# Altium project USB_UART_JTAG.PrjPcb
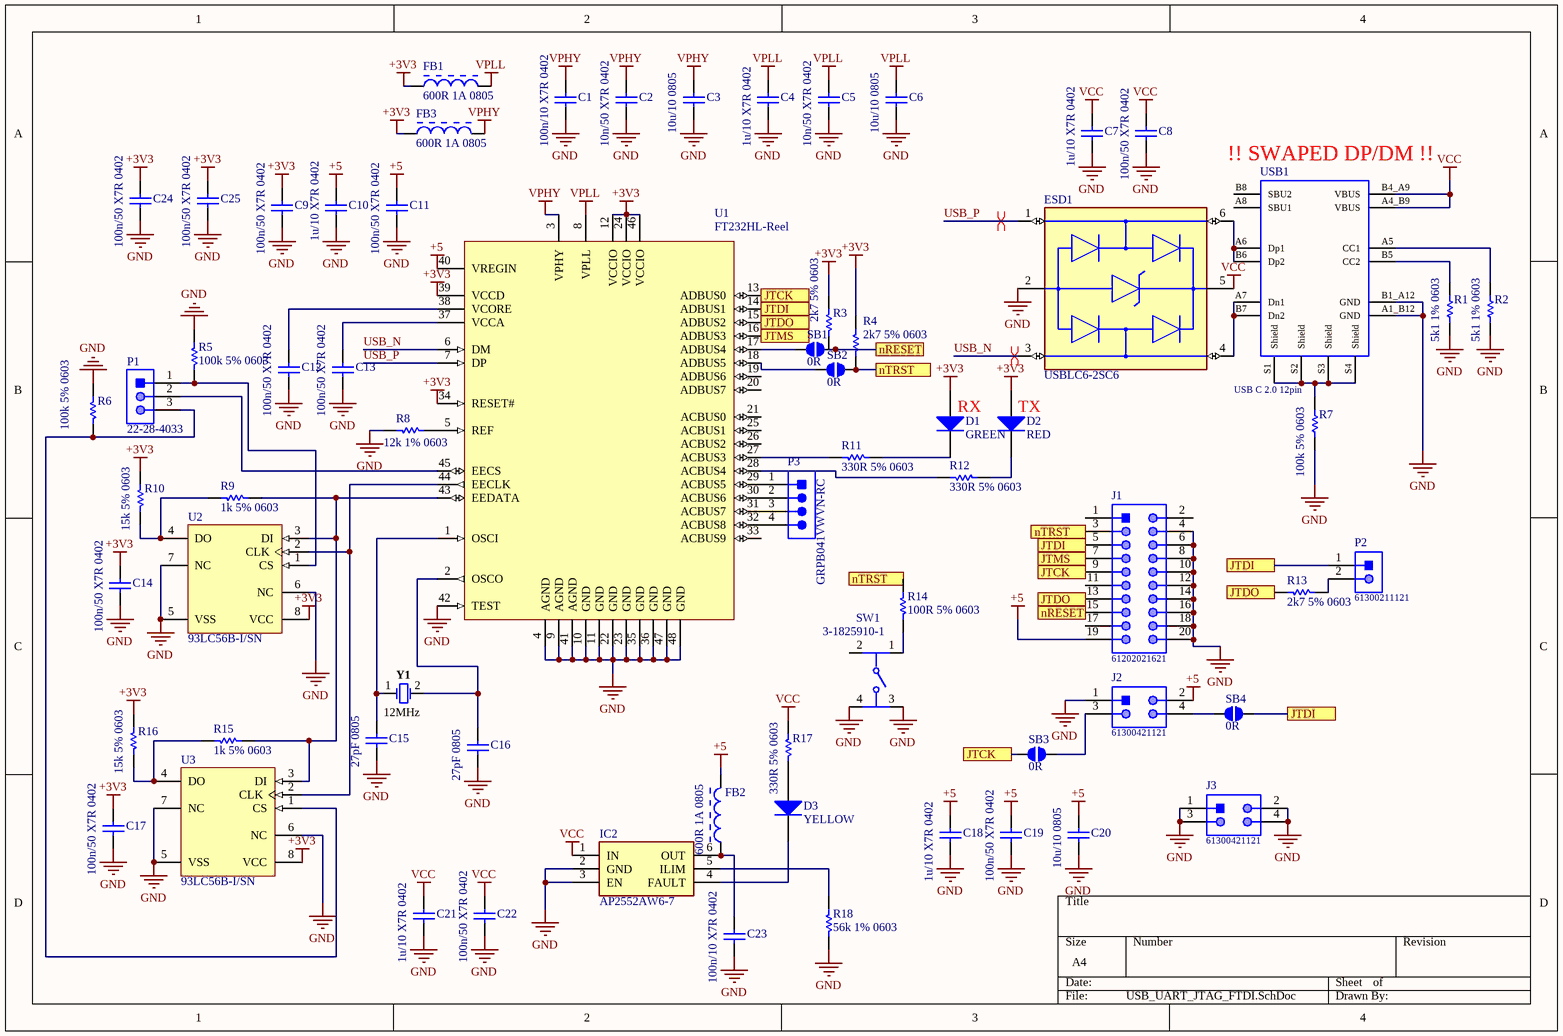
[diagram p0: USB_UART_JTAG_FTDI.SchDoc]
1 sheet, 67 parts. Net scope: flat (ports and power ports of the same name join across sheets).
Board file: USB_UART_JTAG.PcbDoc

## Sheet USB_UART_JTAG_FTDI.SchDoc
size A4

### Parts
C1  100n/10 X7R 0402  [CAPC1005X55X25NL05T10]
C2  10n/50 X7R 0402  [CAPC1005X55X25NL05T10]
C3  10u/10 0805  [CAPC2013X135X50NL10T20]
C4  1u/10 X7R 0402  [CAPC1005X55X25NL05T10]
C5  10n/50 X7R 0402  [CAPC1005X55X25NL05T10]
C6  10u/10 0805  [CAPC2013X135X50NL10T20]
C7  1u/10 X7R 0402  [CAPC1005X55X25NL05T10]
C8  100n/50 X7R 0402  [CAPC1005X55X25NL05T10]
C9  100n/50 X7R 0402  [CAPC1005X55X25NL05T10]
C10  1u/10 X7R 0402  [CAPC1005X55X25NL05T10]
C11  100n/50 X7R 0402  [CAPC1005X55X25NL05T10]
C12  100n/50 X7R 0402  [CAPC1005X55X25NL05T10]
C13  100n/50 X7R 0402  [CAPC1005X55X25NL05T10]
C14  100n/50 X7R 0402  [CAPC1005X55X25NL05T10]
C15  27pF 0805  [CAPC0603(1608)100_N]
C16  27pF 0805  [CAPC0603(1608)100_N]
C17  100n/50 X7R 0402  [CAPC1005X55X25NL05T10]
C18  1u/10 X7R 0402  [CAPC1005X55X25NL05T10]
C19  100n/50 X7R 0402  [CAPC1005X55X25NL05T10]
C20  10u/10 0805  [CAPC2013X135X50NL10T20]
C21  1u/10 X7R 0402  [CAPC1005X55X25NL05T10]
C22  100n/50 X7R 0402  [CAPC1005X55X25NL05T10]
C23  100n/10 X7R 0402  [CAPC1005X55X25NL05T10]
C24  100n/50 X7R 0402  [CAPC1005X55X25NL05T10]
C25  100n/50 X7R 0402  [CAPC1005X55X25NL05T10]
D1  GREEN  [OSRM-LG L29K-F2J1-24_V]
D2  RED  [OSRM-LG L29K-F2J1-24_V]
D3  YELLOW  [OSRM-LG L29K-F2J1-24_V]
ESD1  USBLC6-2SC6  [SOT95P280X145-6N]
FB1  600R 1A 0805  [TDK-MPZ2012_V]
FB2  600R 1A 0805  [TDK-MPZ2012_V]
FB3  600R 1A 0805  [TDK-MPZ2012_V]
IC2  AP2552AW6-7  [SOT95P285X140-6N]
J1  61202021621  [61202021621]
J2  61300421121  [61300421121]
J3  61300421121  [61300421121]
P1  22-28-4033  [MOLX-22-28-4033_V]
P2  61300211121  [61300211121]
P3  GRPB041VWVN-RC  [SLIN-GRPB041VWVN-RC_V]
R1  5k1 1% 0603  [RESC1609X50X30LL10T20]
R2  5k1 1% 0603  [RESC1609X50X30LL10T20]
R3  2k7 5% 0603  [RESC1608X55X30ML20T20]
R4  2k7 5% 0603  [RESC1608X55X30ML20T20]
R5  100k 5% 0603  [RESC1608X55X30ML20T20]
R6  100k 5% 0603  [RESC1608X55X30ML20T20]
R7  100k 5% 0603  [RESC1609X50X30ML10T20]
R8  12k 1% 0603  [RESC1608X55X30ML20T20]
R9  1k 5% 0603  [RESC1608X55X30ML20T20]
R10  15k 5% 0603  [RESC1608X55X30ML20T20]
R11  330R 5% 0603  [RESC1608X55X30ML20T20]
R12  330R 5% 0603  [RESC1608X55X30ML20T20]
R13  2k7 5% 0603  [RESC1608X55X30ML20T20]
R14  100R 5% 0603  [RESC1608X55X30ML20T20]
R15  1k 5% 0603  [RESC1608X55X30ML20T20]
R16  15k 5% 0603  [RESC1608X55X30ML20T20]
R17  330R 5% 0603  [RESC1608X55X30ML20T20]
R18  56k 1% 0603  [RESC1608X55X30ML20T20]
SB1  0R  [SB0603]
SB2  0R  [SB0603]
SB3  0R  [SB0603]
SB4  0R  [SB0603]
SW1  3-1825910-1  [FP-3-1825910-1-MFG]
U1  FT232HL-Reel  [LQFP-48_M]
U2  93LC56B-I/SN  [SOIC-SN8_L]
U3  93LC56B-I/SN  [SOIC-SN8_L]
USB1  USB C 2.0 12pin  [USB_C_12pin]
Y1  12MHz  [FOX-FOXSLF160-20]

### Ports
JTCK, JTDI, JTDO, JTMS, nRESET, nTRST

### Nets
+3V3: C9.2 C14.2 C17.2 C24.2 C25.2 D1.1(A) D2.1(A) FB1.1 FB3.1 R3.2 R4.2 R10.2 R16.2 U1.12(VCCIO) U1.24(VCCIO) U1.34(RESET#) U1.39(VCCD) U1.46(VCCIO) U2.8(VCC) U3.8(VCC)
+5: C10.2 C11.2 C18.2 C19.2 C20.2 FB2.2 J1.19 J2.2 U1.40(VREGIN)
GND: C1.1 C2.1 C3.1 C4.1 C5.1 C6.1 C7.1 C8.1 C9.1 C10.1 C11.1 C12.1 C13.1 C14.1 C15.1 C16.1 C17.1 C18.1 C19.1 C20.1 C21.1 C22.1 C23.1 C24.1 C25.1 ESD1.2(GND) IC2.2(GND) IC2.3(EN) J1.4 J1.6 J1.8 J1.10 J1.12 J1.14 J1.16 J1.18 J1.20 J2.1 J3.1 J3.2 J3.3 J3.4 R1.2 R2.2 R5.2 R6.2 R7.1 R8.2 R18.1 SW1.3 SW1.4 U1.4(AGND) U1.9(AGND) U1.10(GND) U1.11(GND) U1.22(GND) U1.23(GND) U1.35(GND) U1.36(GND) U1.41(AGND) U1.42(TEST) U1.47(GND) U1.48(GND) U2.5(VSS) U2.6(NC) U2.7(NC) U3.5(VSS) U3.6(NC) U3.7(NC) USB1.A1_B12(GND) USB1.B1_A12(GND)
VCC: C7.2 C8.2 C21.2 C22.2 ESD1.5(VBUS) IC2.1(IN) R17.2 USB1.A4_B9(VBUS) USB1.B4_A9(VBUS)
VPHY: C1.2 C2.2 C3.2 FB3.2 U1.3(VPHY)
VPLL: C4.2 C5.2 C6.2 FB1.2 U1.8(VPLL)
USB_N: ESD1.3(I/O2) U1.6(DM)
USB_P: ESD1.1(I/O1) U1.7(DP)
NetC12_2: C12.2 U1.38(VCORE)
NetC13_2: C13.2 U1.37(VCCA)
NetC15_2: C15.2 U1.1(OSCI) Y1.1
NetC16_2: C16.2 U1.2(OSCO) Y1.2
NetC23_2: C23.2 FB2.1 IC2.6(OUT)
NetD1_2: D1.2(K) R11.2
NetD2_2: D2.2(K) R12.2
NetD3_1: D3.1(A) R17.1
NetD3_2: D3.2(K) IC2.4(FAULT)
NetESD1_4: ESD1.4(I/O2) USB1.A7(Dn1) USB1.B7(Dn2)
NetESD1_6: ESD1.6(I/O1) USB1.A6(Dp1) USB1.B6(Dp2)
NetIC2_5: IC2.5(ILIM) R18.2
NetJ1_3: J1.3 R4.1 R14.2 SB2.1 ; port nTRST
NetJ1_5: J1.5 P2.1 SB4.1 U1.14(ADBUS1) ; port JTDI
NetJ1_7: J1.7 U1.16(ADBUS3) ; port JTMS
NetJ1_9: J1.9 SB3.2 U1.13(ADBUS0) ; port JTCK
NetJ1_13: J1.13 R13.1 U1.15(ADBUS2) ; port JTDO
NetJ1_15: J1.15 R3.1 SB1.1 ; port nRESET
NetJ2_3: J2.3 SB3.1
NetJ2_4: J2.4 SB4.2
NetP1_1: P1.1 R5.1 U2.1(CS)
NetP1_2: P1.2 U1.45(EECS)
NetP1_3: P1.3 R6.1 U3.1(CS)
NetP2_2: P2.2 R13.2
NetP3_1: P3.1 U1.29(ACBUS5)
NetP3_2: P3.2 U1.30(ACBUS6)
NetP3_3: P3.3 U1.31(ACBUS7)
NetP3_4: P3.4 U1.32(ACBUS8)
NetR1_1: R1.1 USB1.B5(CC2)
NetR2_1: R2.1 USB1.A5(CC1)
NetR7_2: R7.2 USB1.S1(Shield) USB1.S2(Shield) USB1.S3(Shield) USB1.S4(Shield)
NetR8_1: R8.1 U1.5(REF)
NetR9_1: R9.1 R10.1 U2.4(DO)
NetR9_2: R9.2 R15.2 U1.43(EEDATA) U2.3(DI) U3.3(DI)
NetR11_1: R11.1 U1.27(ACBUS3)
NetR12_1: R12.1 U1.28(ACBUS4)
NetR14_1: R14.1 SW1.1
NetR15_1: R15.1 R16.1 U3.4(DO)
NetSB1_2: SB1.2 U1.17(ADBUS4)
NetSB2_2: SB2.2 U1.18(ADBUS5)
NetU1_44: U1.44(EECLK) U2.2(CLK) U3.2(CLK)

Not connected (* = marked no-connect by the designer): J1 1 2 11 17; SW1 2; U1 19(ADBUS6) 20(ADBUS7) 21(ACBUS0) 25(ACBUS1) 26(ACBUS2) 33(ACBUS9); USB1 A8(SBU1) B8(SBU2)

### Layout directives
differential pair: USB_N, USB_P

### Notes on the sheet
- (near USB1) !! SWAPED DP/DM !!
- (near D1) RX
- (near D2) TX

### Library data of the parts
C1 C2 C4 C5 C7-C14 C17-C19 C21-C25 = CMP-2008-04580-1: Part Number: GRM155R61E104KA87D; Manufacturer: Murata
C3 C6 C20 = CMP-2007-03453-1: Manufacturer: Murata; Part Number: GRM21BR61C106KE15L
C15 C16 = CMP-1035-00783-1: CAP 20pF 50V ±5% 0603 (1608 Metric) Thickness 1mm SMD; Case-EIA: 0603; Case-Metric: 1608; Tolerance: Â±5%; Value: 20pF; Technology: SMT; Rated Voltage: 50 V; Max Thickness: 1 mm
D1-D3 = CMP-2000-07461-1: SmartLED, Green, 1.7 V, 1.4 to 5.6 MCD, -40 to 100 degC, 2-Pin SMD, RoHS, Tape and Reel; Manufacturer: Osram Opto; Forward Current: 20mA; Number of LEDs: 1; Wavelength: 570nm; Test Current: 2mA; Lens Style: Rectangular; Forward Voltage: 1.7V; Luminous Flux: 0.015lm; Lens Colour: Clear; Case\/Package: 0603; Lens Transparency: Diffused; Luminous Intensity: 3.5mcd; Viewing Angle: 160degrees; Colour: Green; Depth: 0.8mm; RoHSCompliant: true; Package Reference: LG L29K-F2J1-24; Mounting Technology: SurfaceMount; Lead Free: LeadFree; Package Quantity: 1; Package Description: 2-Pin Surface Mount Device, Body 0.8 x 1.3 mm; Number of Pins: 2; Width: 0.8mm; Dominant Wavelength: 570nm; Manufacturer URL: https://www.osram.com/os/; Number of Elements: 1; Datasheet URL: http://datasheet.octopart.com/LG-L29K-F2J1-24-Osram-datasheet-41480516.pdf; Contact Plating: Matte; Height: 0.65mm; Case Code (Imperial): 0603; Case Code (Metric): 1608; Length: 1.7mm; Radiation Hardening: No; Packaging: TapeandReel; Mount: SurfaceMount; Min Operating Temperature: -40degC; Max Operating Temperature: 100degC; Datasheet Version: 10/2012
ESD1 = USBLC6-2SC6: Integrated Circuit; Manufacturer_Name: STMicroelectronics; Datasheet Link: http://www.st.com/st-web-ui/static/active/en/resource/technical/document/datasheet/CD00050750.pdf; Height: 1.45mm; Manufacturer_Part_Number: USBLC6-2SC6; Arrow Part Number: USBLC6-2SC6; Arrow Price/Stock: https://www.arrow.com/en/products/usblc6-2sc6/stmicroelectronics; Mouser Part Number: 511-USBLC6-2SC6; Mouser Price/Stock: https://www.mouser.co.uk/ProductDetail/STMicroelectronics/USBLC6-2SC6?qs=po45yt2pPpu%2FhNIlwQdTlg%3D%3D
FB1-FB3 = CMP-2000-05401-1: Chip Bead, 0.1 Ohm, 2 A, -55 to 125 degC, 2-Pin SMD (0805), RoHS, Tape and Reel; PCN Part Number: MMZ,MPSSeriesOct/2014; Manufacturer: TDK; Impedance @ Frequency: 600Ohm@100MHz; Other Names: 445-2206-6; Catalog Drawings: (MMZ,MPZ)2012SeriesTop / (MMZ,MPZ)2012SeriesFootprint / (MMZ,MPZ)2012SeriesSide; DC Resistance (DCR): 100mOhmMax; Current Rating: 2A; Product Training Modules: EMCComponents; Filter Type: DifferentialMode-Single; Online Catalog: MPZ2012Series; Datasheet URL: http://datasheet.octopart.com/MPZ2012S601AT000-TDK-datasheet-12512619.pdf; Size / Dimension: 0.079"Lx0.049"W(2.00mmx1.25mm); Package Reference: 805; Package / Case: 0805(2012Metric); Packaging: Digi-Reel; Mounting Type: SurfaceMount; Family: FerriteBeadsandChips; Category: Filters; Height (Max): 0.041"(1.05mm); Datasheet Version: Sep-12; Manufacturer URL: http://www.tdk.com/; Series: MPZ; Package Description: 2-Pin Surface Mount Device, Body 2 x 1.25 mm; Standard Package: 1
IC2 = AP2552AW6-7: Integrated Circuit; Manufacturer_Name: Diodes Inc.; Datasheet Link: https://www.diodes.com/assets/Datasheets/AP255x.pdf; Height: 1.4mm; Manufacturer_Part_Number: AP2552AW6-7; Arrow Part Number: AP2552AW6-7; Mouser Part Number: 621-AP2552AW6-7; Mouser Price/Stock: https://www.mouser.co.uk/ProductDetail/Diodes-Incorporated/AP2552AW6-7?qs=wo71MgyKIyGuD7yeQlWo%2Fw%3D%3D
J1 = CMP-1502-00010-1: Male Box Header WR-BHD, THT, Vertical, pitch 2.54 mm, 20 pins; Manufacturer: Wurth Elektronik; Contact Resistance: 20mOhm; Withstanding Voltage: 500VAC; Pitch: 2.54mm; Pin Number: 20; Working Voltage: 250VAC; Orientation: Vertical; Package Reference: 61202021621; Publisher: WurthElektronik; Datasheet URL: https://katalog.we-online.de/em/datasheet/6120xx21621.pdf; Operating Temperature: -40to125degC; Packaging: Tray; Part Number: 61202021621; Mounting Technology: THT; Gender: Male; Manufacturer URL: http://www.we-online.de; Published Date: August2018
J2 J3 = CMP-1502-01066-1: THT Vertical Pin Header WR-PHD, Pitch 2.54 mm, Dual Row, 4 pins; Manufacturer: Wurth Elektronik; Working Voltage: 250VAC; Contact Resistance: 20mOhm; Pitch: 2.54mm; Rated Current: 3A; Withstanding Voltage: 500VAC; Pin Number: 4; Gender: Male; Operating Temperature: -40to105degC; Packaging: Bag; Manufacturer URL: http://www.we-online.de; Package Reference: 61300421121; Row Number: Dual; Publisher: WurthElektronik; Mounting Technology: THT; Orientation: Vertical; Part Number: 61300421121; Datasheet URL: https://katalog.we-online.de/em/datasheet/6130xx21121.pdf
P1 = CMP-1676-00001-5: Male Header, Pitch 2.54 mm, 1 x 3 Position, Height 8.38 mm, Tail Length 3.18 mm, RoHS, Bulk; Manufacturer: Molex; Rows: 1; Voltage Rating: 250 V; Current Rating: 4 A; Min Operating Temperature: 0 degC; Lead Pitch: 0.1 inch; Packaging: Bulk; Contact Finish: Gold; RoHSCompliant: true; Contact Material: Brass; PackageReference: 22-28-4033; REACH SVHC: Unknown; PackageDescription: Male Header, Pitch 2.54 mm, 1 x 3 Position, Height 8.38 mm, Tail Length 3.18 mm; ComponentLink2URL: http://www.molex.com/pdm_docs/sd/022284033_sd.pdf; Height: 8.38 mm; Mounting Technology: Through Hole; ComponentLink1Description: Manufacturer URL; Length: 7.62 mm; Mount: Through Hole; DatasheetVersion: Rev. G, 01/2012; Max Operating Temperature: 75 degC; ComponentLink2Description: Datasheet; Colour: Black; Pins: 3; Contact Plating: Gold; Package Quantity: 1; ComponentLink1URL: http://www.molex.com/
P2 = CMP-1502-01060-1: THT Vertical Pin Header WR-PHD, Pitch 2.54 mm, Single Row, 2 pins; Manufacturer: Wurth Elektronik; Rated Current: 3A; Gender: Male; Withstanding Voltage: 500VAC; Working Voltage: 250VAC; Pitch: 2.54mm; Contact Resistance: 20mOhm; Pin Number: 2; Mounting Technology: THT; Orientation: Vertical; Operating Temperature: -40to105degC; Packaging: Bag; Publisher: WurthElektronik; Datasheet URL: https://katalog.we-online.de/em/datasheet/6130xx11121.pdf; Manufacturer URL: http://www.we-online.de; Row Number: Single; Package Reference: 61300211121; Part Number: 61300211121
P3 = CMP-2000-06373-1: Male Header, Pitch 1.27 mm, 1 x 4 Position, Height 4 mm, Tail Length 2.3 mm, -40 to 105 degC, RoHS, Bulk; Manufacturer: Sullins; Mating Products: S9010E-04-ND / -CONNHEADER.050"4POSR/APCB / S9008E-04-ND / -CONNHEADER.050"4POSPCBGOLD / S9005E-04-ND / -CONNHEADER.050"4POSSMDGOLD; Other Names: S9014E-04; Dynamic Catalog: GRPB; Pitch: 0.050"(1.27mm); Number of Positions Loaded: All; Number of Positions: 4; Catalog Drawings: S9014ESeriesTop; Connector Type: Header,Unshrouded; Contact Finish Thickness: Flash; Number of Rows: 1; Contact Type: MalePin; Category: Connectors,Interconnects; Contact Mating Length: 0.118"(3.00mm); Family: RectangularConnectors-Headers,MalePins; Datasheet Version: Rev. C, 12/2008; Contact Finish: Gold; Termination: Solder; Manufacturer URL: http://www.sullinscorp.com/; Mounting Type: ThroughHole; Packaging: Bulk; Package Reference: GRPB041VWVN-RC; Datasheet URL: http://www.sullinscorp.com/drawings/71_GRPB___1VWVN-RC,_10957-C.pdf; Mounting Technology: ThroughHole; Package Description: Male Header, Pitch 1.27 mm, 1 x 4 Position, Height 4 mm, Tail Length 2.3 mm; Standard Package: 1
R1 R2 = CMP-2000-03606-1: Part Number: CRCW060382R0FKEA; Manufacturer: Vishay Dale
R3-R6 R8-R18 = CMP-2000-00873-1: Manufacturer: Panasonic; Part Number: ERA3AEB102V
R7 = CMP-2000-03821-1: Manufacturer: Vishay Dale; Part Number: CRCW0603100KFKEB
SB1-SB4 = SB: Manufacturer: Panasonic; Part Number: ERA3AEB102V
SW1 = CMP-03407-000001-1: SWITCH TACTILE SPST-NO 0.05A 24V; Manufacturer: TE Connectivity; Operating Force: 160gf; Contact Current Rating: 50mA; Contact Resistance: 100mΩ; Electromechanical Life: 100000Cycles; Device Class L1: Electromechanical; ComponentLink2URL: https://www.te.com/commerce/DocumentDelivery/DDEController?Action=srchrtrv&DocNm=1825910&DocType=Customer+Drawing&DocLang=English; Category: Switch; Device Class L2: Switches; Temperature: -35°C to +85°C; RoHS: TRUE; Mount: Through Hole; Manufacturer Part Number: 3-1825910-1; Automotive: No; Lead Free: Yes; Device Class L3: Tactile Switches; ComponentLink2Description: Datasheet; Temperature Range High: +85°C; Height: 17.3mm; Package: 0; Temperature Range Low: -35°C; Throw Configuration: SPST-NO; Digikey Description: SWITCH TACTILE SPST-NO 0.05A 24V; Octopart: https://octopart.com/3-1825910-1-te+connectivity-46506874
U1 = CMP-0078-00035-3: Single Channel Hi-Speed USB to Multipurpose UART/FIFO IC, 48-pin LQFP, Tape and Reel; Manufacturer: FTDI; RevisionNote: DatasheetVersion updated to 1.8 Dec-2012; ComponentLink1Description: Manufacturer URL; DatasheetVersion: ver 1.8, Dec-2012; PackageReference: LQFP-48; PartNumber: FT232HL-Reel; ComponentLink2Description: Datasheet; PackageVersion: Dec-12; PackageDescription: 48-Pin Thin Quad Flat Pack, 7 x 7 mm Body, 0.5 mm Pitch; ComponentLink2URL: http://www.ftdichip.com/Support/Documents/DataSheets/ICs/DS_FT232H.pdf; ComponentLink1URL: http://www.ftdichip.com/
U2 U3 = CMP-0162-00077-1: 2K, 128x16-bit, 2.5V Microwire Serial EEPROM, 8-Pin SOIC 150mil, Industrial Temperature; Code_IPC: SOIC127P600-8; PackageVersion: revBB, Aug-2009; PackageDescription: 8-Lead Plastic Small Outline (SN) - Narrow, 3.90mm Body [SOIC]; DatasheetVersion: revF, May-2008; PackageReference: SOIC-SN8; Code_JEDEC: MS-012
USB1 = USB C 2.0 12pin: USB 2.0 Type C Receptacle WR-COM, Horizontal, SMT / THT; Part Number: 632723100011; Manufacturer: Wurth Elektronik; Working Voltage: 20VDC; Rated Current: 5A; Connector Type: USB3.1TypeC; Contact Resistance: 30mOhm; Operating Temperature: -40to105degC; Publisher: WurthElektronik; Gender: Receptacle; Mounting Technology: SMT/THT; Datasheet URL: https://katalog.we-online.de/em/datasheet/632723x00011%282%29.pdf; Manufacturer URL: http://www.we-online.de; Orientation: Horizontal; Package Reference: 632723100011; Packaging: TapeandReel
Y1 = CMP-1749-00003-1: Resistance Weld Thru-Hole Crystal, 16 MHz, -20 to 70 degC, 2-Pin THD, RoHS, Bulk; Voltage Rating: 250 V; Tolerance: 1%; Resistance: 221 kohm; Case\Package: Axial; Power Rating: 250 mW; RoHSCompliant: true; Package Quantity: 200; Packaging: Bulk; Min Operating Temperature: -55 degC; DatasheetVersion: Mar-15; ComponentLink1URL: http://www.foxonline.com/; Max Operating Temperature: 155 degC; PackageReference: FOXSLF160-20; Mount: Through Hole; PackageDescription: 2-Pin Through Hole Device, Body 11.35 x 4.65 mm; ComponentLink1Description: Manufacturer URL; ComponentLink2URL: http://www.foxonline.com/pdfs/hc49slf.pdf; ComponentLink2Description: Datasheet; Length: 0.248 inch